# Altium schematic sheet 01-SURGE_PROTECT.SchDoc
size A4
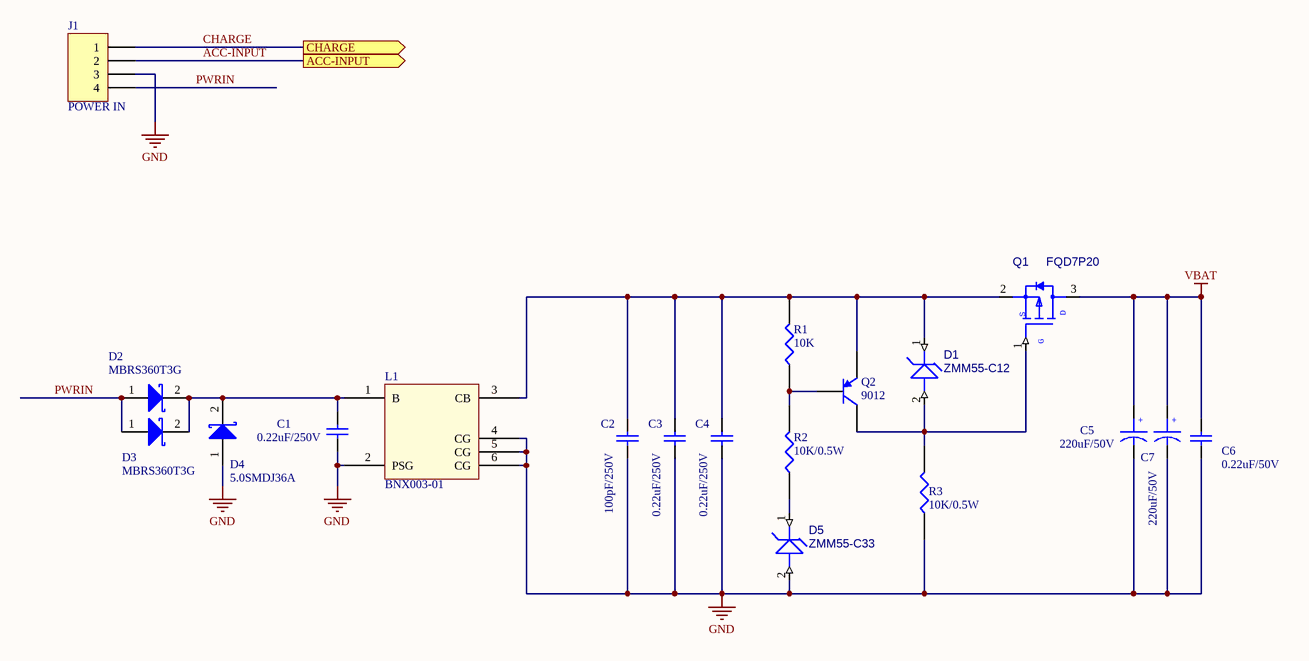
[diagram p0: 01-SURGE_PROTECT.SchDoc]

## Parts
C1  0.22uF/250V  [1210]
C2  100pF/250V  [0805]
C3  0.22uF/250V  [1210]
C4  0.22uF/250V  [1210]
C5  220uF/50V  [DL-10*10.5]
C6  0.22uF/50V  [0603]
C7  220uF/50V  [DL-10*10.5]
D1  ZMM55-C12  [MINI-MELF]
D2  MBRS360T3G  [SMC]
D3  MBRS360T3G  [SMC]
D4  5.0SMDJ36A  [SMC]
D5  ZMM55-C33  [MINI-MELF]
J1  POWER IN  [3030WV-F-2*2P]
L1  BNX003-01  [BNX002-001]
Q1  FQD7P20  [FQD7P20]
Q2  9012  [NPN]
R1  10K  [0402]
R2  10K/0.5W  [1812]
R3  10K/0.5W  [1812]

## Ports
ACC-INPUT (out), CHARGE (out)

## Nets
GND: C1.2 C2.2 C3.2 C4.2 C5.2 C6.2 C7.2 D4.1(A) D5.2 J1.3 L1.2(PSG) L1.4(CG) L1.5(CG) L1.6(CG) R3.1
VBAT: C5.1 C6.1 C7.1 Q1.3(D)
ACC-INPUT: J1.2 ; port ACC-INPUT
CHARGE: J1.1 ; port CHARGE
PWRIN: D2.1(A) D3.1(A) J1.4
NetC1_1: C1.1 D2.2(K) D3.2(K) D4.2(K) L1.1(B)
NetC2_1: C2.1 C3.1 C4.1 D1.1 L1.3(CB) Q1.2(S) Q2.3(E) R1.2
NetD1_2: D1.2 Q1.1(G) Q2.1(C) R3.2
NetD5_1: D5.1 R2.1
NetQ2_2: Q2.2(B) R1.1 R2.2

## Notes on the sheet
- (in symbol CAP WP) +

## Library data of the parts
C1-C4 C6 = Cap: Capacitor; Published: 8-Jun-2000; LatestRevisionDate: 17-Jul-2002; LatestRevisionNote: Re-released for DXP Platform.; PackageReference: RAD-0.3; Publisher: Altium Limited; PackageDescription: Radial Cap, Thru-Hole; 2 Leads; 0.3 in Pin Spacing
C5 C7 = CAP WP
D1 D5 = MMGZ5231BPTLL34
D2-D4 = Diode 11DQ03: Schottky Rectifier
J1 = Header 4: Header, 4-Pin; LatestRevisionDate: 17-Jul-2002; LatestRevisionNote: Re-released for DXP Platform.; Publisher: Altium Limited
L1 = BNX002-01
Q1 = AO3401L_SOT23-3_0: Part Number: SB934010010; ROOM: USB POWER; Part Value: AO3401L_SOT23-3
Q2 = PNP: PNP Bipolar Transistor; Published: 8-Jun-2000; LatestRevisionDate: 29-May-2009; LatestRevisionNote: IPC-7351 Footprint Added.; PackageVersion: Aug-1999; PackageReference: SOT-23B; Publisher: Altium Limited; PackageDescription: 3-Pin SOT-23 Package 0.95 mm Pitch, 2.4 mm Lead Span
R1-R3 = RES1